# Altium project B202AA-PCIe.PrjPcb (part 1 of 2)
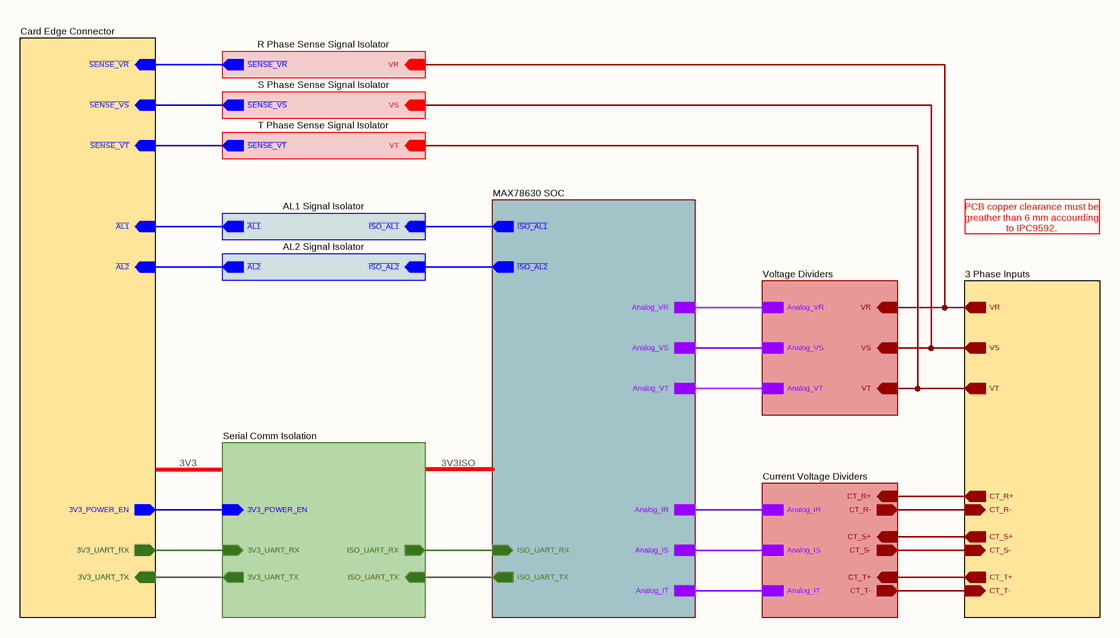
[diagram p0: Block Diagram.SchDoc]
Address1_: Buyuk Kayacik Mah. 4. OSB; Address2_: 103. Cad. No : 12; Address3_: Selcuklu / Konya; Address4_: Türkiye; Copyright_: Copyright 2022 STF Tarim (Commercial Secret); Customer_: -; Engineer_: Gunce Akkoyun; Git_Repo_Address_: www.github.com/akkoyun/B202AA-PCIe; Module_ID_: B202AA-PCIe; Organization_: -; Product_Desc_: PollyPhase Energy Analyzer; Product_ID_: B202AA-PCIe; Revision_: 00.00.01; Version_: R1
12 sheets, 136 parts. Net scope: hierarchical (ports join the sheet entries above them; power ports are global).
Board files: B202AA-PCIe.PcbDoc, B202AA.PcbDoc
Sheets:
  Block Diagram.SchDoc
    MAX78630 SOC = MAX78630 SOC.SchDoc
    Voltage Dividers = Phase Voltage Dividers.SchDoc
    Current Voltage Dividers = Current Voltage Dividers.SchDoc
    3 Phase Inputs = Energy Inputs.SchDoc
    Card Edge Connector = Card Edge Connecgtor.SchDoc
    R Phase Sense Signal Isolator = R Phase Sense Signal Isolation.SchDoc
    S Phase Sense Signal Isolator = S Phase Sense Signal Isolation.SchDoc
    T Phase Sense Signal Isolator = T Phase Sense Signal Isolation.SchDoc
    AL1 Signal Isolator = AL1 Signal Isolation.SchDoc
    AL2 Signal Isolator = AL2 Signal Isolation.SchDoc
    Serial Comm Isolation = UART Comm Isolation.SchDoc

## Sheet Block Diagram.SchDoc: B202AA Block Diagram
size 393 x 292 mm; SheetNumber: 1; SheetTotal: 12

### Sub-sheets
3 Phase Inputs = Energy Inputs.SchDoc: VS (out), VR (out), CT_S+ (out), CT_T+ (out), VT (out), CT_R+ (out), CT_R- (in), CT_S- (in), CT_T- (in)
AL1 Signal Isolator = AL1 Signal Isolation.SchDoc: ~{AL1} (out), ~{ISO_AL1} (in)
AL2 Signal Isolator = AL2 Signal Isolation.SchDoc: ~{AL2} (out), ~{ISO_AL2} (in)
Card Edge Connector = Card Edge Connecgtor.SchDoc: 3V3_UART_RX (out), 3V3_UART_TX (in), ~{AL2} (in), ~{AL1} (in), ~{SENSE_VT} (in), ~{SENSE_VS} (in), ~{SENSE_VR} (in), 3V3_POWER_EN (out)
Current Voltage Dividers = Current Voltage Dividers.SchDoc: Analog_IS, Analog_IT, Analog_IR, CT_T+ (in), CT_S+ (in), CT_R+ (in), CT_R- (out), CT_S- (out), CT_T- (out)
MAX78630 SOC = MAX78630 SOC.SchDoc: Analog_VR, Analog_VS, Analog_VT, Analog_IS, Analog_IT, Analog_IR, ISO_UART_RX (in), ISO_UART_TX (out), ~{ISO_AL1} (out), ~{ISO_AL2} (out)
R Phase Sense Signal Isolator = R Phase Sense Signal Isolation.SchDoc: ~{SENSE_VR} (out), VR (in)
S Phase Sense Signal Isolator = S Phase Sense Signal Isolation.SchDoc: ~{SENSE_VS} (out), VS (in)
Serial Comm Isolation = UART Comm Isolation.SchDoc: 3V3_UART_TX (out), 3V3_UART_RX (in), ISO_UART_RX (out), ISO_UART_TX (in), 3V3_POWER_EN (in)
T Phase Sense Signal Isolator = T Phase Sense Signal Isolation.SchDoc: ~{SENSE_VT} (out), VT (in)
Voltage Dividers = Phase Voltage Dividers.SchDoc: Analog_VR, Analog_VS, Analog_VT, VR (in), VT (in), VS (in)

### Nets
3V3_POWER_EN: sheet Card Edge Connector/3V3_POWER_EN, sheet Serial Comm Isolation/3V3_POWER_EN
3V3_UART_RX: sheet Card Edge Connector/3V3_UART_RX, sheet Serial Comm Isolation/3V3_UART_RX
3V3_UART_TX: sheet Card Edge Connector/3V3_UART_TX, sheet Serial Comm Isolation/3V3_UART_TX
~{AL1}: sheet Card Edge Connector/~{AL1}, sheet AL1 Signal Isolator/~{AL1}
~{AL2}: sheet Card Edge Connector/~{AL2}, sheet AL2 Signal Isolator/~{AL2}
Analog_IR: sheet MAX78630 SOC/Analog_IR, sheet Current Voltage Dividers/Analog_IR
Analog_IS: sheet MAX78630 SOC/Analog_IS, sheet Current Voltage Dividers/Analog_IS
Analog_IT: sheet MAX78630 SOC/Analog_IT, sheet Current Voltage Dividers/Analog_IT
Analog_VR: sheet MAX78630 SOC/Analog_VR, sheet Voltage Dividers/Analog_VR
Analog_VS: sheet MAX78630 SOC/Analog_VS, sheet Voltage Dividers/Analog_VS
Analog_VT: sheet MAX78630 SOC/Analog_VT, sheet Voltage Dividers/Analog_VT
CT_R+: sheet Current Voltage Dividers/CT_R+, sheet 3 Phase Inputs/CT_R+
CT_R-: sheet Current Voltage Dividers/CT_R-, sheet 3 Phase Inputs/CT_R-
CT_S+: sheet Current Voltage Dividers/CT_S+, sheet 3 Phase Inputs/CT_S+
CT_S-: sheet Current Voltage Dividers/CT_S-, sheet 3 Phase Inputs/CT_S-
CT_T+: sheet Current Voltage Dividers/CT_T+, sheet 3 Phase Inputs/CT_T+
CT_T-: sheet Current Voltage Dividers/CT_T-, sheet 3 Phase Inputs/CT_T-
~{ISO_AL1}: sheet MAX78630 SOC/~{ISO_AL1}, sheet AL1 Signal Isolator/~{ISO_AL1}
~{ISO_AL2}: sheet MAX78630 SOC/~{ISO_AL2}, sheet AL2 Signal Isolator/~{ISO_AL2}
ISO_UART_RX: sheet MAX78630 SOC/ISO_UART_RX, sheet Serial Comm Isolation/ISO_UART_RX
ISO_UART_TX: sheet MAX78630 SOC/ISO_UART_TX, sheet Serial Comm Isolation/ISO_UART_TX
~{SENSE_VR}: sheet Card Edge Connector/~{SENSE_VR}, sheet R Phase Sense Signal Isolator/~{SENSE_VR}
~{SENSE_VS}: sheet Card Edge Connector/~{SENSE_VS}, sheet S Phase Sense Signal Isolator/~{SENSE_VS}
~{SENSE_VT}: sheet Card Edge Connector/~{SENSE_VT}, sheet T Phase Sense Signal Isolator/~{SENSE_VT}
VR: sheet Voltage Dividers/VR, sheet 3 Phase Inputs/VR, sheet R Phase Sense Signal Isolator/VR
VS: sheet Voltage Dividers/VS, sheet 3 Phase Inputs/VS, sheet S Phase Sense Signal Isolator/VS
VT: sheet Voltage Dividers/VT, sheet 3 Phase Inputs/VT, sheet T Phase Sense Signal Isolator/VT

### Notes on the sheet
- PCB copper clearance must be greather than 6 mm accourding to IPC9592.
- 3V3
- 3V3ISO
- © 2021 All rights reserved.
  This document may not, in whole or in part, be copied, photocopied, reproduced, translated or converted to any electronic or machine readable from without prior written permission of Mehmet Günce Akkoyun.
  Engineer contact : akkoyun@me.com
- Property of
- Engineer :
- Date :
- Size :
- A4
- Time :
- Project :
- Page :
- /
- Customer :
- Product ID :
- Module ID :
- Version :
- File :
- Revision :

## Sheet MAX78630 SOC.SchDoc: MAX78630 SOC Core
size 393 x 292 mm; SheetNumber: 12; SheetTotal: 12
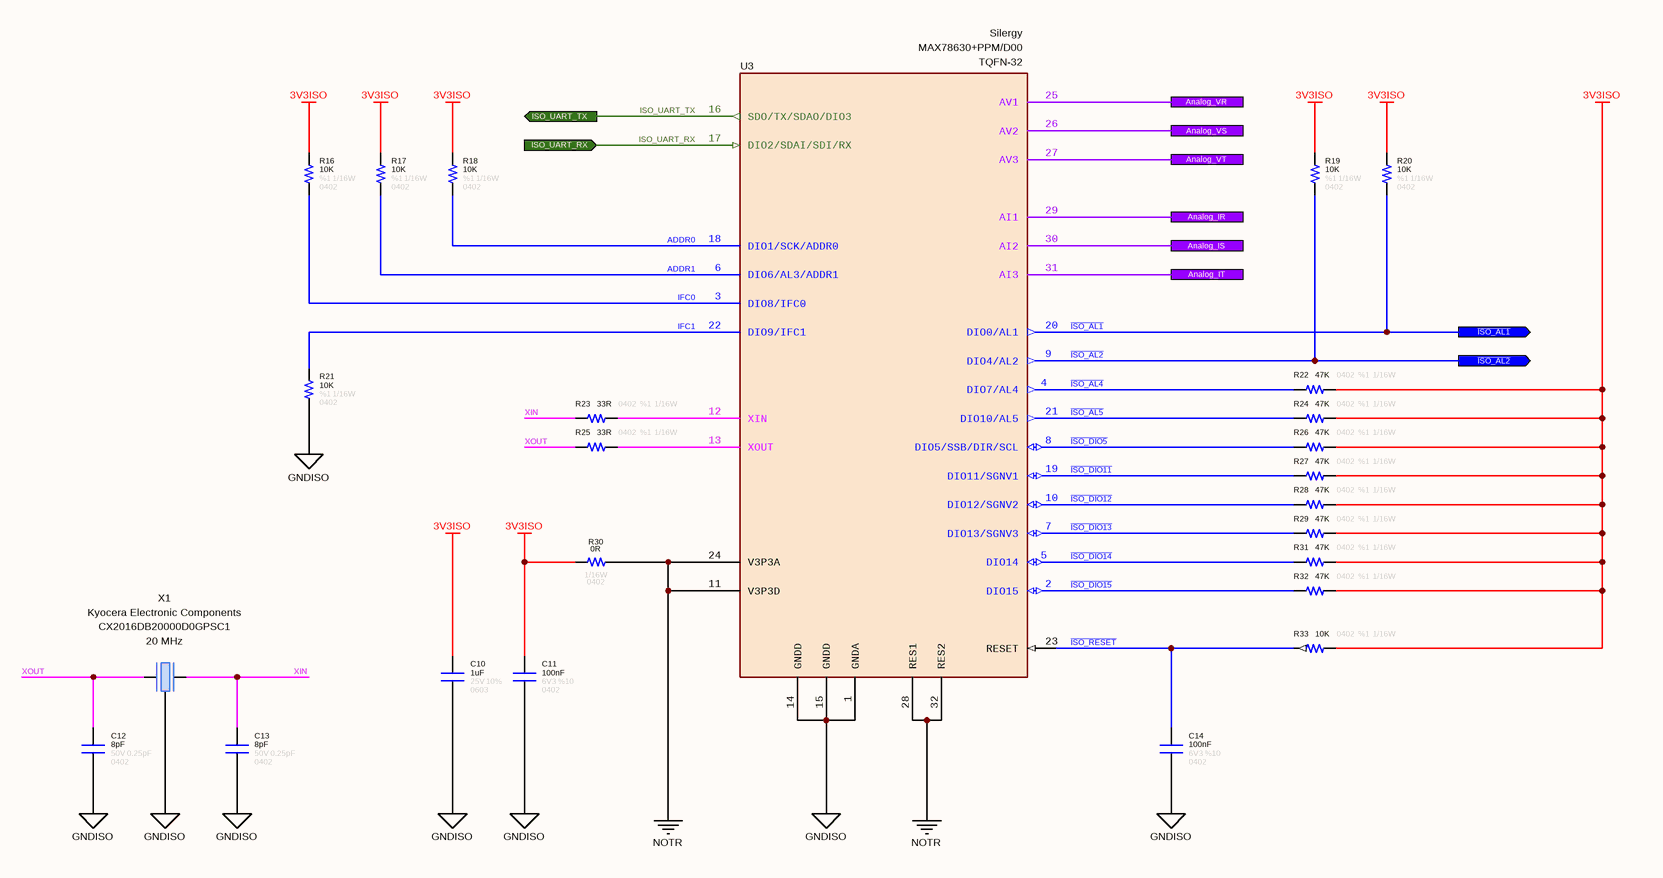
[diagram p1: MAX78630 SOC.SchDoc]

### Parts
C10  value 1uF  Tolerance: 10%  Case: 0603  Voltage: 25V  [CAPACITOR_0603]  (hidden comment: Capacitor - 1uF [0603] (MLCC))
C11  value 100nF  Tolerance: %10  Voltage: 6V3  Case: 0402  [CAPACITOR_0402]  (hidden comment: Capacitor - 100nF [0402] (Ceramic))
C12  value 8pF  Tolerance: 0.25pF  Case: 0402  Voltage: 50V  [CAPACITOR_0402]  (hidden comment: Capacitor - 8pF [0402] (Ceramic))
C13  value 8pF  Tolerance: 0.25pF  Case: 0402  Voltage: 50V  [CAPACITOR_0402]  (hidden comment: Capacitor - 8pF [0402] (Ceramic))
C14  value 100nF  Tolerance: %10  Voltage: 6V3  Case: 0402  [CAPACITOR_0402]  (hidden comment: Capacitor - 100nF [0402] (Ceramic))
R16  value 10K  Tolerance: %1  Case: 0402  Power: 1/16W  [RESISTOR_0402]  (hidden comment: 10K - 0402 - %1 - 1/16W)
R17  value 10K  Tolerance: %1  Case: 0402  Power: 1/16W  [RESISTOR_0402]  (hidden comment: 10K - 0402 - %1 - 1/16W)
R18  value 10K  Tolerance: %1  Case: 0402  Power: 1/16W  [RESISTOR_0402]  (hidden comment: 10K - 0402 - %1 - 1/16W)
R19  value 10K  Tolerance: %1  Case: 0402  Power: 1/16W  [RESISTOR_0402]  (hidden comment: 10K - 0402 - %1 - 1/16W)
R20  value 10K  Tolerance: %1  Case: 0402  Power: 1/16W  [RESISTOR_0402]  (hidden comment: 10K - 0402 - %1 - 1/16W)
R21  value 10K  Tolerance: %1  Case: 0402  Power: 1/16W  [RESISTOR_0402]  (hidden comment: 10K - 0402 - %1 - 1/16W)
R22  value 47K  Tolerance: %1  Case: 0402  Power: 1/16W  [RESISTOR_0402]  (hidden comment: 47K - 0402 - %1 - 1/16W)
R23  value 33R  Case: 0402  Tolerance: %1  Power: 1/16W  [RESISTOR_0402]  (hidden comment: 33R - 0402 - %1 - 1/16W)
R24  value 47K  Tolerance: %1  Case: 0402  Power: 1/16W  [RESISTOR_0402]  (hidden comment: 47K - 0402 - %1 - 1/16W)
R25  value 33R  Case: 0402  Tolerance: %1  Power: 1/16W  [RESISTOR_0402]  (hidden comment: 33R - 0402 - %1 - 1/16W)
R26  value 47K  Tolerance: %1  Case: 0402  Power: 1/16W  [RESISTOR_0402]  (hidden comment: 47K - 0402 - %1 - 1/16W)
R27  value 47K  Tolerance: %1  Case: 0402  Power: 1/16W  [RESISTOR_0402]  (hidden comment: 47K - 0402 - %1 - 1/16W)
R28  value 47K  Tolerance: %1  Case: 0402  Power: 1/16W  [RESISTOR_0402]  (hidden comment: 47K - 0402 - %1 - 1/16W)
R29  value 47K  Tolerance: %1  Case: 0402  Power: 1/16W  [RESISTOR_0402]  (hidden comment: 47K - 0402 - %1 - 1/16W)
R30  value 0R  Case: 0402  Power: 1/16W  [RESISTOR_0402]  (hidden comment: 0R - 0402 - %1 - 1/16W)
R31  value 47K  Tolerance: %1  Case: 0402  Power: 1/16W  [RESISTOR_0402]  (hidden comment: 47K - 0402 - %1 - 1/16W)
R32  value 47K  Tolerance: %1  Case: 0402  Power: 1/16W  [RESISTOR_0402]  (hidden comment: 47K - 0402 - %1 - 1/16W)
R33  value 10K  Tolerance: %1  Case: 0402  Power: 1/16W  [RESISTOR_0402]  (hidden comment: 10K - 0402 - %1 - 1/16W)
U3  Manufacturer Name: Silergy  Case: TQFN-32  [TQFN-32 - Maxim]  (hidden comment: MAX78630+PPM/D00)
X1  Manufacturer Name: Kyocera Electronic Components  Frequency: 20 MHz  [CRYSTAL - 20MHz]  (hidden comment: CX2016DB20000D0GPSC1)

### Ports
Analog_IR, Analog_IS, Analog_IT, Analog_VR, Analog_VS, Analog_VT, ISO_UART_RX (in), ISO_UART_TX (out), ~{ISO_AL1} (out), ~{ISO_AL2} (out)

### Nets
3V3ISO: C10.2 C11.2 R16.2 R17.2 R18.2 R19.2 R20.2 R22.1 R24.1 R26.1 R27.1 R28.1 R29.1 R30.2 R31.1 R32.1 R33.1
GNDISO: C10.1 C11.1 C12.1 C13.1 C14.1 R21.1 U3.1(GNDA) U3.14(GNDD) U3.15(GNDD) X1.2(GND)
NOTR: R30.1 U3.11(V3P3D) U3.24(V3P3A) U3.28(RES1) U3.32(RES2)
ADDR0: R18.1 U3.18(DIO1/SCK/ADDR0)
ADDR1: R17.1 U3.6(DIO6/AL3/ADDR1)
Analog_IR: U3.29(AI1) ; port Analog_IR
Analog_IS: U3.30(AI2) ; port Analog_IS
Analog_IT: U3.31(AI3) ; port Analog_IT
Analog_VR: U3.25(AV1) ; port Analog_VR
Analog_VS: U3.26(AV2) ; port Analog_VS
Analog_VT: U3.27(AV3) ; port Analog_VT
~{ISO_AL1}: R20.1 U3.20(DIO0/AL1) ; port ~{ISO_AL1}
~{ISO_AL2}: R19.1 U3.9(DIO4/AL2) ; port ~{ISO_AL2}
~{ISO_AL4}: R22.2 U3.4(DIO7/AL4)
~{ISO_AL5}: R24.2 U3.21(DIO10/AL5)
~{ISO_DIO11}: R27.2 U3.19(DIO11/SGNV1)
~{ISO_DIO12}: R28.2 U3.10(DIO12/SGNV2)
~{ISO_DIO13}: R29.2 U3.7(DIO13/SGNV3)
~{ISO_DIO14}: R31.2 U3.5(DIO14)
~{ISO_DIO15}: R32.2 U3.2(DIO15)
~{ISO_DIO5}: R26.2 U3.8(DIO5/SSB/DIR/SCL)
~{ISO_RESET}: C14.2 R33.2 U3.23(RESET)
IFC0: R16.1 U3.3(DIO8/IFC0)
IFC1: R21.2 U3.22(DIO9/IFC1)
ISO_UART_RX: U3.17(DIO2/SDAI/SDI/RX) ; port ISO_UART_RX
ISO_UART_TX: U3.16(SDO/TX/SDAO/DIO3) ; port ISO_UART_TX
XIN: C13.2 R23.2 X1.1(IN/OUT)
XOUT: C12.2 R25.2 X1.3(OUT/IN)
NetR23_1: R23.1 U3.12(XIN)
NetR25_1: R25.1 U3.13(XOUT)

Not connected (* = marked no-connect by the designer): X1 4(GND)

### Notes on the sheet
- © 2021 All rights reserved.
  This document may not, in whole or in part, be copied, photocopied, reproduced, translated or converted to any electronic or machine readable from without prior written permission of Mehmet Günce Akkoyun.
  Engineer contact : akkoyun@me.com
- Property of
- Engineer :
- Date :
- Size :
- A4
- Time :
- Project :
- Page :
- /
- Customer :
- Product ID :
- Module ID :
- Version :
- File :
- Revision :

### Library data of the parts
C10 = Capacitor - 1uF [0603-25V]: Capacitor (MLCC) - 1uF / 25V / 0603; Manufacturer Part Number: GCJ188R71E105KA01D; Manufacturer Name: Murata Electronics; ComponentLink1Description: DataSheet; ComponentLink1URL: https://www.mouser.com.tr/datasheet/2/281/1/GCJ188R71E105KA01_02B-3140112.pdf; ComponentLink2Description: Mouser; ComponentLink2URL: https://www.mouser.com.tr/ProductDetail/Murata-Electronics/GCJ188R71E105KA01D?qs=rnuWwpjhhVuRpUqK416FbQ%3D%3D; Subcategory: Capacitors
C11 C14 = Capacitor - 100nF [0402-6V3]: Capacitor - 100nF [0402-6V3] (Ceramic); Manufacturer Name: AVX; Manufacturer Part Number: 04026D104KAT4A; ComponentLink1Description: Mouser; ComponentLink1URL: https://www.mouser.com.tr/ProductDetail/AVX/04026D104KAT4A?qs=sGAEpiMZZMs0AnBnWHyRQPg4iYkCw7IMED%2F4kpqgf7w%3D; ComponentLink2Description: DataSheet; ComponentLink2URL: https://www.mouser.com.tr/datasheet/2/40/cx5r-776519.pdf
C12 C13 = Capacitor - 8pF [0402-50V]: Manufacturer Name: KYOCERA AVX; Manufacturer Part Number: 04025A8R0CAT2A
R16-R21 R33 = Resistor - 10K [0402]: Thick Film Resistors - SMD 1/16 W 10 KOhm 1%; Manufacturer Name: Vishay; Manufacturer Part Number: CRCW040210K0FKED; ComponentLink1Description: DataSheet; ComponentLink1URL: https://www.mouser.com.tr/datasheet/2/427/dcrcwe3-1762152.pdf; ComponentLink2Description: Mouser; ComponentLink2URL: https://www.mouser.com.tr/ProductDetail/Vishay-Dale/CRCW040210K0FKED?qs=sGAEpiMZZMu61qfTUdNhG2DpbjADlD3GcalbOv9utCY%3D
R22 R24 R26-R29 R31 R32 = Resistor - 47K [0402]: Thick Film Resistors - SMD 1/16 W 47 KOhm 1%; Manufacturer Name: Vishay; Manufacturer Part Number: CRCW040247K0FKED; ComponentLink1Description: DataSheet; ComponentLink1URL: https://www.mouser.com.tr/datasheet/2/427/dcrcwe3-1762152.pdf; ComponentLink2Description: Mouser; ComponentLink2URL: https://www.mouser.com.tr/ProductDetail/Vishay-Dale/CRCW040247K0FKED?qs=sGAEpiMZZMu61qfTUdNhG2DpbjADlD3GL%252B3h1elTxqU%3D
R23 R25 = Resistor - 33R [0402]: Thick Film Resistors - SMD 1/16 W 33 Ohm 1%; Manufacturer Name: Vishay; Manufacturer Part Number: CRCW040233R0FKED; ComponentLink1Description: DataSheet; ComponentLink1URL: https://www.mouser.com.tr/datasheet/2/427/dcrcwe3-1762152.pdf; ComponentLink2Description: Mouser; ComponentLink2URL: https://www.mouser.com.tr/ProductDetail/Vishay-Dale/CRCW0402330RFKED?qs=sGAEpiMZZMu61qfTUdNhG2DpbjADlD3GGS6SwBlLi5Q%3D
R30 = Resistor - 0R [0402]: Thick Film Resistors - SMD 1/16 W 0 Ohm; Manufacturer Name: Vishay; Manufacturer Part Number: CRCW04020000Z0ED; ComponentLink1Description: DataSheet; ComponentLink1URL: https://www.mouser.com.tr/datasheet/2/427/dcrcwe3-1762152.pdf; ComponentLink2Description: Mouser; ComponentLink2URL: https://www.mouser.com.tr/ProductDetail/Vishay-Dale/CRCW04020000Z0ED?qs=sGAEpiMZZMu61qfTUdNhG2DpbjADlD3GG34cJb50zyg%3D
U3 = IC - MAX78630: Energy Measurement Processor 32-Pin TQFN EP Tube; RoHS: Yes; Manufacturer Part Number: MAX78630+PPM/D00
X1 = Crystal - 20MHz: Crystals AEC-Q200 20000kHz 8pF 2x1.6mm; Case: SMD; Manufacturer Part Number: CX2016DB20000D0GPSC1

## Sheet Phase Voltage Dividers.SchDoc: 3 Phase Voltage Dividers
size 292 x 193 mm; SheetNumber: 10; SheetTotal: 12
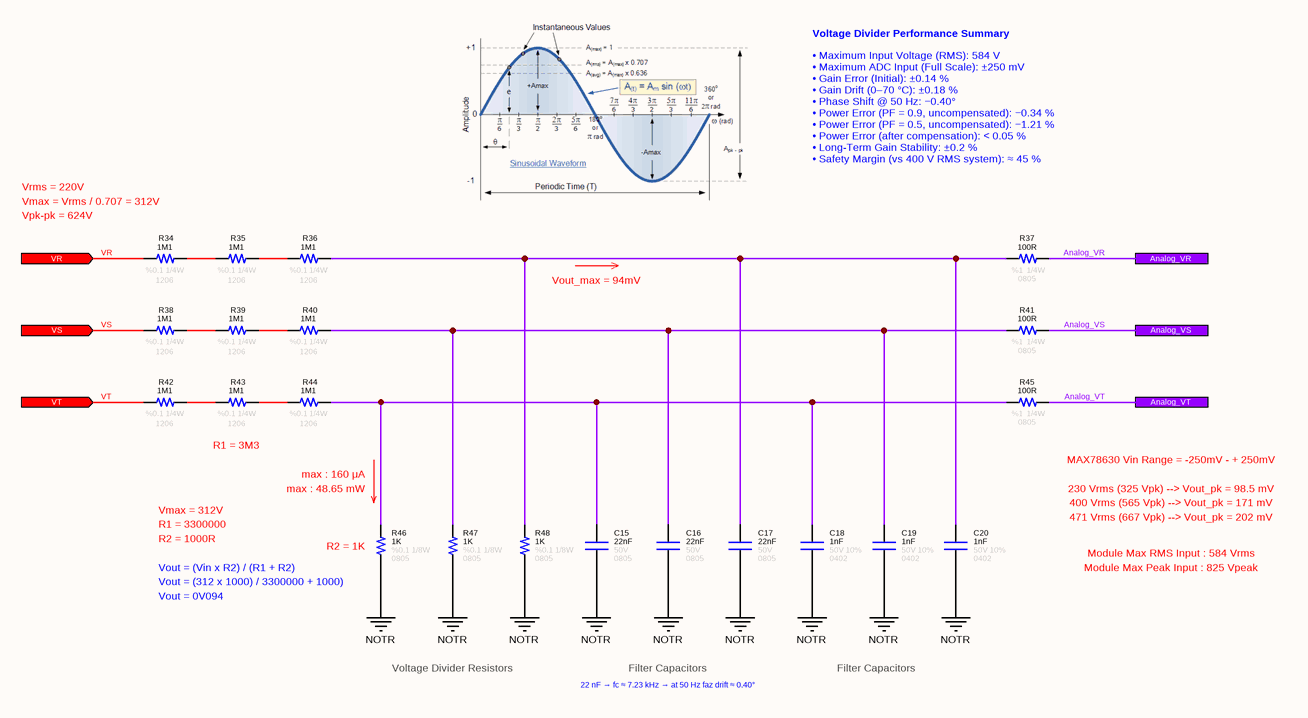
[diagram p2: Phase Voltage Dividers.SchDoc]

### Parts
C15  value 22nF  Case: 0805  Voltage: 50V  [CAPACITOR_0805]  (hidden comment: Capacitor - 22nF [0805] (MLCC))
C16  value 22nF  Case: 0805  Voltage: 50V  [CAPACITOR_0805]  (hidden comment: Capacitor - 22nF [0805] (MLCC))
C17  value 22nF  Case: 0805  Voltage: 50V  [CAPACITOR_0805]  (hidden comment: Capacitor - 22nF [0805] (MLCC))
C18  value 1nF  Tolerance: 10%  Case: 0402  Voltage: 50V  [CAPACITOR_0402]  (hidden comment: Capacitor - 1nF [0402] (MLCC))
C19  value 1nF  Tolerance: 10%  Case: 0402  Voltage: 50V  [CAPACITOR_0402]  (hidden comment: Capacitor - 1nF [0402] (MLCC))
C20  value 1nF  Tolerance: 10%  Case: 0402  Voltage: 50V  [CAPACITOR_0402]  (hidden comment: Capacitor - 1nF [0402] (MLCC))
R34  value 1M1  Case: 1206  Tolerance: %0.1  Power: 1/4W  [RESISTOR_1206]  (hidden comment: 1M1 - 1206 - %1 - 1/4W)
R35  value 1M1  Case: 1206  Tolerance: %0.1  Power: 1/4W  [RESISTOR_1206]  (hidden comment: 1M1 - 1206 - %1 - 1/4W)
R36  value 1M1  Case: 1206  Tolerance: %0.1  Power: 1/4W  [RESISTOR_1206]  (hidden comment: 1M1 - 1206 - %1 - 1/4W)
R37  value 100R  Case: 0805  Tolerance: %1  Power: 1/4W  [RESISTOR_0805]  (hidden comment: 100R - 0805 - %1 - 1/4W)
R38  value 1M1  Case: 1206  Tolerance: %0.1  Power: 1/4W  [RESISTOR_1206]  (hidden comment: 1M1 - 1206 - %1 - 1/4W)
R39  value 1M1  Case: 1206  Tolerance: %0.1  Power: 1/4W  [RESISTOR_1206]  (hidden comment: 1M1 - 1206 - %1 - 1/4W)
R40  value 1M1  Case: 1206  Tolerance: %0.1  Power: 1/4W  [RESISTOR_1206]  (hidden comment: 1M1 - 1206 - %1 - 1/4W)
R41  value 100R  Case: 0805  Tolerance: %1  Power: 1/4W  [RESISTOR_0805]  (hidden comment: 100R - 0805 - %1 - 1/4W)
R42  value 1M1  Case: 1206  Tolerance: %0.1  Power: 1/4W  [RESISTOR_1206]  (hidden comment: 1M1 - 1206 - %1 - 1/4W)
R43  value 1M1  Case: 1206  Tolerance: %0.1  Power: 1/4W  [RESISTOR_1206]  (hidden comment: 1M1 - 1206 - %1 - 1/4W)
R44  value 1M1  Case: 1206  Tolerance: %0.1  Power: 1/4W  [RESISTOR_1206]  (hidden comment: 1M1 - 1206 - %1 - 1/4W)
R45  value 100R  Case: 0805  Tolerance: %1  Power: 1/4W  [RESISTOR_0805]  (hidden comment: 100R - 0805 - %1 - 1/4W)
R46  value 1K  Tolerance: %0.1  Case: 0805  Power: 1/8W  [RESISTOR_0805]  (hidden comment: 1K - 0805 - %0.1 - 1/8W)
R47  value 1K  Tolerance: %0.1  Case: 0805  Power: 1/8W  [RESISTOR_0805]  (hidden comment: 1K - 0805 - %0.1 - 1/8W)
R48  value 1K  Tolerance: %0.1  Case: 0805  Power: 1/8W  [RESISTOR_0805]  (hidden comment: 1K - 0805 - %0.1 - 1/8W)

### Ports
Analog_VR, Analog_VS, Analog_VT, VR (in), VS (in), VT (in)

### Nets
NOTR: C15.1 C16.1 C17.1 C18.1 C19.1 C20.1 R46.1 R47.1 R48.1
Analog_VR: R37.1 ; port Analog_VR
Analog_VS: R41.1 ; port Analog_VS
Analog_VT: R45.1 ; port Analog_VT
VR: R34.2 ; port VR
VS: R38.2 ; port VS
VT: R42.2 ; port VT
NetC15_2: C15.2 C18.2 R44.1 R45.2 R46.2
NetC16_2: C16.2 C19.2 R40.1 R41.2 R47.2
NetC17_2: C17.2 C20.2 R36.1 R37.2 R48.2
NetR34_1: R34.1 R35.2
NetR35_1: R35.1 R36.2
NetR38_1: R38.1 R39.2
NetR39_1: R39.1 R40.2
NetR42_1: R42.1 R43.2
NetR43_1: R43.1 R44.2

### Notes on the sheet
- Voltage Divider Performance Summary
- Vrms = 220V
- (near R34) Vmax = Vrms / 0.707 = 312V
- Vpk-pk = 624V
- • Maximum Input Voltage (RMS): 584 V
  • Maximum ADC Input (Full Scale): ±250 mV
  • Gain Error (Initial): ±0.14 %
  • Gain Drift (0–70 °C): ±0.18 %
  • Phase Shift @ 50 Hz: −0.40°
  • Power Error (PF = 0.9, uncompensated): −0.34 %
  • Power Error (PF = 0.5, uncompensated): −1.21 %
  • Power Error (after compensation): < 0.05 %
  • Long-Term Gain Stability: ±0.2 %
  • Safety Margin (vs 400 V RMS system): ≈ 45 %
- Vout_max = 94mV
- R1 = 3M3
- max : 160 μA
- (near R46) max : 48.65 mW
- MAX78630 Vin Range = -250mV - + 250mV
- 230 Vrms (325 Vpk) --> Vout_pk = 98.5 mV
- 400 Vrms (565 Vpk) --> Vout_pk = 171 mV
- Vout = (Vin x R2) / (R1 + R2)
- Vmax = 312V
- R1 = 3300000
- R2 = 1000R
- (near R46) Vout = (312 x 1000) / 3300000 + 1000)
- (near R46) R2 = 1K
- Module Max RMS Input : 584 Vrms
- Module Max Peak Input : 825 Vpeak
- 471 Vrms (667 Vpk) --> Vout_pk = 202 mV
- Vout = 0V094
- Voltage Divider Resistors
- 22 nF → fc ≈ 7.23 kHz → at 50 Hz faz drift ≈ 0.40°
- Filter Capacitors
- © 2021 All rights reserved.
  This document may not, in whole or in part, be copied, photocopied, reproduced, translated or converted to any electronic or machine readable from without prior written permission of Mehmet Günce Akkoyun.
  Engineer contact : akkoyun@me.com
- Property of
- Engineer :
- Date :
- Size :
- A4
- Time :
- Project :
- Page :
- /
- Customer :
- Product ID :
- Module ID :
- Version :
- File :
- Revision :

### Library data of the parts
C15-C17 = Capacitor - 22nF [0805-50V]: Capacitor (MLCC) - 22nF / 50V / 0805; Manufacturer Name: Yageo; Manufacturer Part Number: C0805C223K5RACTU; Tolerance: 10%; Subcategory: Capacitors
C18-C20 = Capacitor - 1nF [0402-50V]: Capacitor (MLCC) - 1nF / 50V / 0402; Manufacturer Name: Murata; Manufacturer Part Number: GRM155R71H102KA01D; Subcategory: Capacitors
R34-R36 R38-R40 R42-R44 = Resistor - 1M1 [1206] %0.1: Thick Film Resistors - SMD 1/4 W 1.1 MOhm 0.1%; Manufacturer Name: Yageo; Manufacturer Part Number: RT1206BRD071M1L
R37 R41 R45 = Resistor - 100R [0805]: Thick Film Resistors - SMD 1/4 W 100 Ohm 1%; Manufacturer Name: Vishay; Manufacturer Part Number: CRCW0805100RFKEA
R46-R48 = Resistor - 1K [0805]: Thick Film Resistors - SMD 1/8 W 1 KOhm 0.1%; Manufacturer Name: Panasonic; Manufacturer Part Number: ERA-6AEB102V

## Sheet Current Voltage Dividers.SchDoc: 3 Phase Current Voltage Dividers
size 292 x 193 mm; SheetNumber: 11; SheetTotal: 12
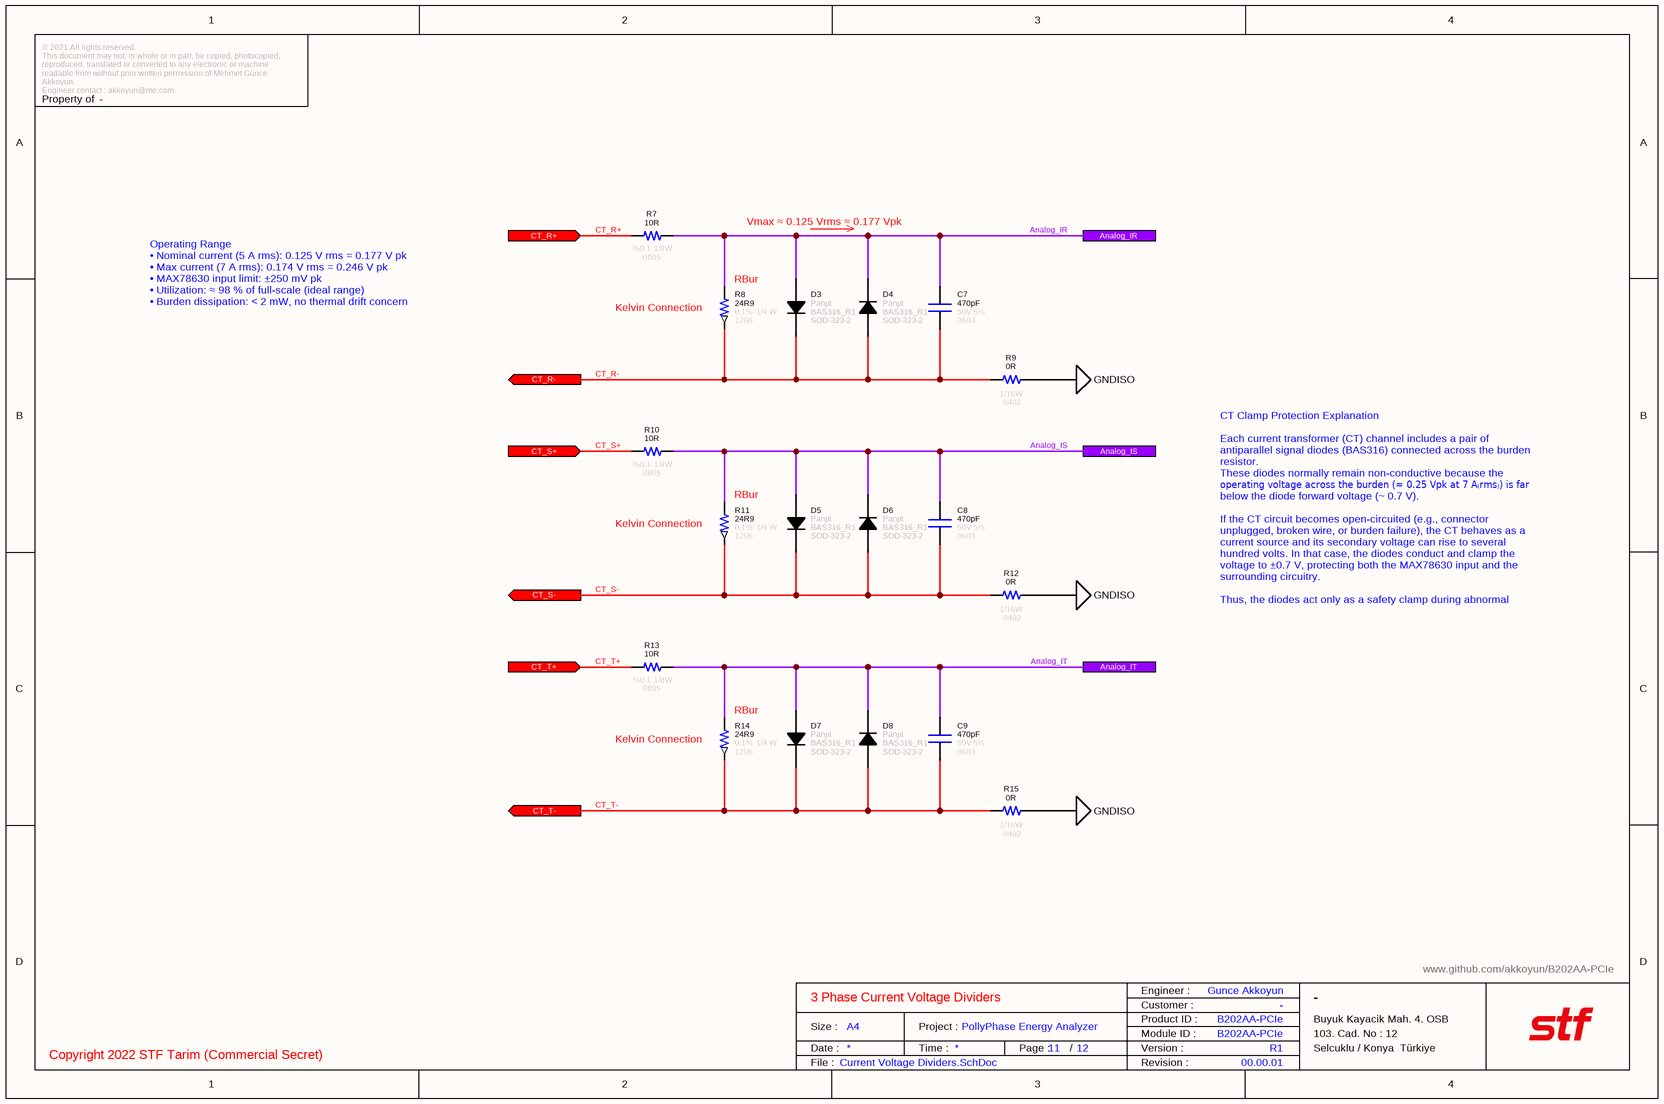
[diagram p3: Current Voltage Dividers.SchDoc]

### Parts
C7  value 470pF  Tolerance: 5%  Case: 0603  Voltage: 50V  [CAPACITOR_0603]  (hidden comment: Capacitor - 470pF [0603] (MLCC))
C8  value 470pF  Tolerance: 5%  Case: 0603  Voltage: 50V  [CAPACITOR_0603]  (hidden comment: Capacitor - 470pF [0603] (MLCC))
C9  value 470pF  Tolerance: 5%  Case: 0603  Voltage: 50V  [CAPACITOR_0603]  (hidden comment: Capacitor - 470pF [0603] (MLCC))
D3  Manufacturer Name: Panjit  Manufacturer Part Number: BAS316_R1  [SOD-323-2]  (hidden comment: BAS316_R1_00001)
D4  Manufacturer Name: Panjit  Manufacturer Part Number: BAS316_R1  [SOD-323-2]  (hidden comment: BAS316_R1_00001)
D5  Manufacturer Name: Panjit  Manufacturer Part Number: BAS316_R1  [SOD-323-2]  (hidden comment: BAS316_R1_00001)
D6  Manufacturer Name: Panjit  Manufacturer Part Number: BAS316_R1  [SOD-323-2]  (hidden comment: BAS316_R1_00001)
D7  Manufacturer Name: Panjit  Manufacturer Part Number: BAS316_R1  [SOD-323-2]  (hidden comment: BAS316_R1_00001)
D8  Manufacturer Name: Panjit  Manufacturer Part Number: BAS316_R1  [SOD-323-2]  (hidden comment: BAS316_R1_00001)
R7  value 10R  Tolerance: %0.1  Case: 0805  Power: 1/8W  [RESISTOR_0805]  (hidden comment: 10R - 0805 - %0.1 - 1/8W)
R8  value 24R9  Tolerance: 0.1%  Power: 1/4 W  Case: 1206  [RESISTOR_1206]  (hidden comment: 24R9 - 1206 - %0.1 - 1/4W)
R9  value 0R  Case: 0402  Power: 1/16W  [RESISTOR_0402]  (hidden comment: 0R - 0402 - %1 - 1/16W)
R10  value 10R  Tolerance: %0.1  Case: 0805  Power: 1/8W  [RESISTOR_0805]  (hidden comment: 10R - 0805 - %0.1 - 1/8W)
R11  value 24R9  Tolerance: 0.1%  Power: 1/4 W  Case: 1206  [RESISTOR_1206]  (hidden comment: 24R9 - 1206 - %0.1 - 1/4W)
R12  value 0R  Case: 0402  Power: 1/16W  [RESISTOR_0402]  (hidden comment: 0R - 0402 - %1 - 1/16W)
R13  value 10R  Tolerance: %0.1  Case: 0805  Power: 1/8W  [RESISTOR_0805]  (hidden comment: 10R - 0805 - %0.1 - 1/8W)
R14  value 24R9  Tolerance: 0.1%  Power: 1/4 W  Case: 1206  [RESISTOR_1206]  (hidden comment: 24R9 - 1206 - %0.1 - 1/4W)
R15  value 0R  Case: 0402  Power: 1/16W  [RESISTOR_0402]  (hidden comment: 0R - 0402 - %1 - 1/16W)

### Ports
Analog_IR, Analog_IS, Analog_IT, CT_R+ (in), CT_R- (out), CT_S+ (in), CT_S- (out), CT_T+ (in), CT_T- (out)

### Nets
GNDISO: R9.1 R12.1 R15.1
Analog_IR: C7.2 D3.2(Anode) D4.1(Cathode) R7.1 R8.2 ; port Analog_IR
Analog_IS: C8.2 D5.2(Anode) D6.1(Cathode) R10.1 R11.2 ; port Analog_IS
Analog_IT: C9.2 D7.2(Anode) D8.1(Cathode) R13.1 R14.2 ; port Analog_IT
CT_R+: R7.2 ; port CT_R+
CT_R-: C7.1 D3.1(Cathode) D4.2(Anode) R8.1 R9.2 ; port CT_R-
CT_S+: R10.2 ; port CT_S+
CT_S-: C8.1 D5.1(Cathode) D6.2(Anode) R11.1 R12.2 ; port CT_S-
CT_T+: R13.2 ; port CT_T+
CT_T-: C9.1 D7.1(Cathode) D8.2(Anode) R14.1 R15.2 ; port CT_T-

### Notes on the sheet
- Vmax ≈ 0.125 Vrms ≈ 0.177 Vpk
- Operating Range
  • Nominal current (5 A rms): 0.125 V rms = 0.177 V pk
  • Max current (7 A rms): 0.174 V rms = 0.246 V pk
  • MAX78630 input limit: ±250 mV pk
  • Utilization: ≈ 98 % of full-scale (ideal range)
  • Burden dissipation: < 2 mW, no thermal drift concern
- (near R8) Kelvin Connection
- (near R8) RBur
- (near R11) Kelvin Connection
- (near R11) RBur
- CT Clamp Protection Explanation
  Each current transformer (CT) channel includes a pair of antiparallel signal diodes (BAS316) connected across the burden resistor.
  These diodes normally remain non-conductive because the operating voltage across the burden (≈ 0.25 Vpk at 7 A₍rms₎) is far below the diode forward voltage (~ 0.7 V).
  If the CT circuit becomes open-circuited (e.g., connector unplugged, broken wire, or burden failure), the CT behaves as a current source and its secondary voltage can rise to several hundred volts. In that case, the diodes conduct and clamp the voltage to ±0.7 V, protecting both the MAX78630 input and the surrounding circuitry.
  Thus, the diodes act only as a safety clamp during abnormal conditions, without affecting normal measurement accuracy or phase angle.
- (near R14) Kelvin Connection
- (near R14) RBur
- © 2021 All rights reserved.
  This document may not, in whole or in part, be copied, photocopied, reproduced, translated or converted to any electronic or machine readable from without prior written permission of Mehmet Günce Akkoyun.
  Engineer contact : akkoyun@me.com
- Property of
- Engineer :
- Date :
- Size :
- A4
- Time :
- Project :
- Page :
- /
- Customer :
- Product ID :
- Module ID :
- Version :
- File :
- Revision :

### Library data of the parts
C7-C9 = Capacitor - 470 pF [0603-50V]: Capacitor (MLCC) - 470pF / 50V / 0603; Manufacturer Name: Murata; Manufacturer Part Number: GRM1885C1H471JA01; Subcategory: Capacitors
D3-D8 = Diode - BAS316_R1_00001: Small Signal Switching Diodes 100V,Small Signal Switching Diodes,SOD-323,4A; Forward Voltage: 150 mV; Forward Current: 4 A; Maximum Operating Temperature: + 150 C; Minimum Operating Temperature: - 55 C; Product Type: Small Signal Switching Diodes; RoHS: Yes; Case: SOD-323-2
R7 R10 R13 = Resistor - 10R [0805]: Thick Film Resistors - SMD 1/8 W 10 Ohm 0.1%; Manufacturer Name: Yageo; Manufacturer Part Number: RT0805BRD0710RL
R8 R11 R14 = Resistor - 24R9 [1206]: Burden Resistors - SMD 1/4 W 24.9 Ohm 0.1%; Manufacturer Part Number: RT1206BRD0724R9L; Manufacturer Name: Yageo
R9 R12 R15 = Resistor - 0R [0402]: as R30 on sheet MAX78630 SOC; ComponentLink1Description: DataSheet; ComponentLink1URL: https://www.mouser.com.tr/datasheet/2/427/dcrcwe3-1762152.pdf; ComponentLink2Description: Mouser; ComponentLink2URL: https://www.mouser.com.tr/ProductDetail/Vishay-Dale/CRCW04020000Z0ED?qs=sGAEpiMZZMu61qfTUdNhG2DpbjADlD3GG34cJb50zyg%3D

## Sheet Energy Inputs.SchDoc: Energy Inputs
size 292 x 193 mm; SheetNumber: 9; SheetTotal: 12
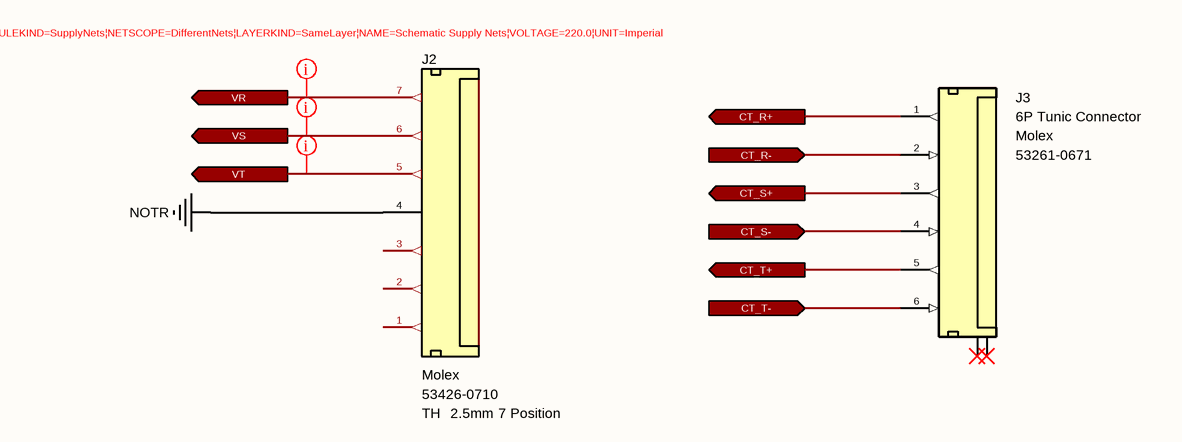
[diagram p4: Energy Inputs.SchDoc]

### Parts
J2  Manufacturer Name: Molex  Case: TH  Pitch: 2.5mm  Position: 7 Position  [Connector 7P (2.54)]  (hidden comment: 53426-0710)
J3  6P Tunic Connector  Manufacturer Part Number: 53261-0671  Manufacturer Name: Molex  [Connector_Tunic 6P]

### Ports
CT_R+ (out), CT_R- (in), CT_S+ (out), CT_S- (in), CT_T+ (out), CT_T- (in), VR (out), VS (out), VT (out)

### Nets
NOTR: J2.4(Pin-4)
CT_R+: J3.1(CT_R+) ; port CT_R+
CT_R-: J3.2(CT_R-) ; port CT_R-
CT_S+: J3.3(CT_S+) ; port CT_S+
CT_S-: J3.4(CT_S-) ; port CT_S-
CT_T+: J3.5(CT_T+) ; port CT_T+
CT_T-: J3.6(CT_T-) ; port CT_T-
VR: J2.7(Pin-7) ; port VR
VS: J2.6(Pin-6) ; port VS
VT: J2.5(Pin-5) ; port VT

Not connected (* = marked no-connect by the designer): J2 1(Pin-1) 2(Pin-2) 3(Pin-3); J3 7(Case)* 8(Case)*

### Layout directives
rule Supply Nets [Voltage = 220.0]; net class HV: VR, VS, VT

### Notes on the sheet
- © 2021 All rights reserved.
  This document may not, in whole or in part, be copied, photocopied, reproduced, translated or converted to any electronic or machine readable from without prior written permission of Mehmet Günce Akkoyun.
  Engineer contact : akkoyun@me.com
- Property of
- Engineer :
- Date :
- Size :
- A4
- Time :
- Project :
- Page :
- /
- Customer :
- Product ID :
- Module ID :
- Version :
- File :
- Revision :

### Library data of the parts
J2 = Connector - Tunic 7P (2.5): 2.50mm Pitch Mini-Lock Wire-to-Board Header Right Angle Friction and Positive Lock 7 Circuits; System: Connector; Manufacturer Part Number: 53426-0710
J3 = Connector - Mini Tunic 6P (1.25): Mini Tunic Connector with 6P; ROHS: Yes

## Sheet Card Edge Connecgtor.SchDoc: Card Edge Connector
size 292 x 193 mm; SheetNumber: 2; SheetTotal: 12
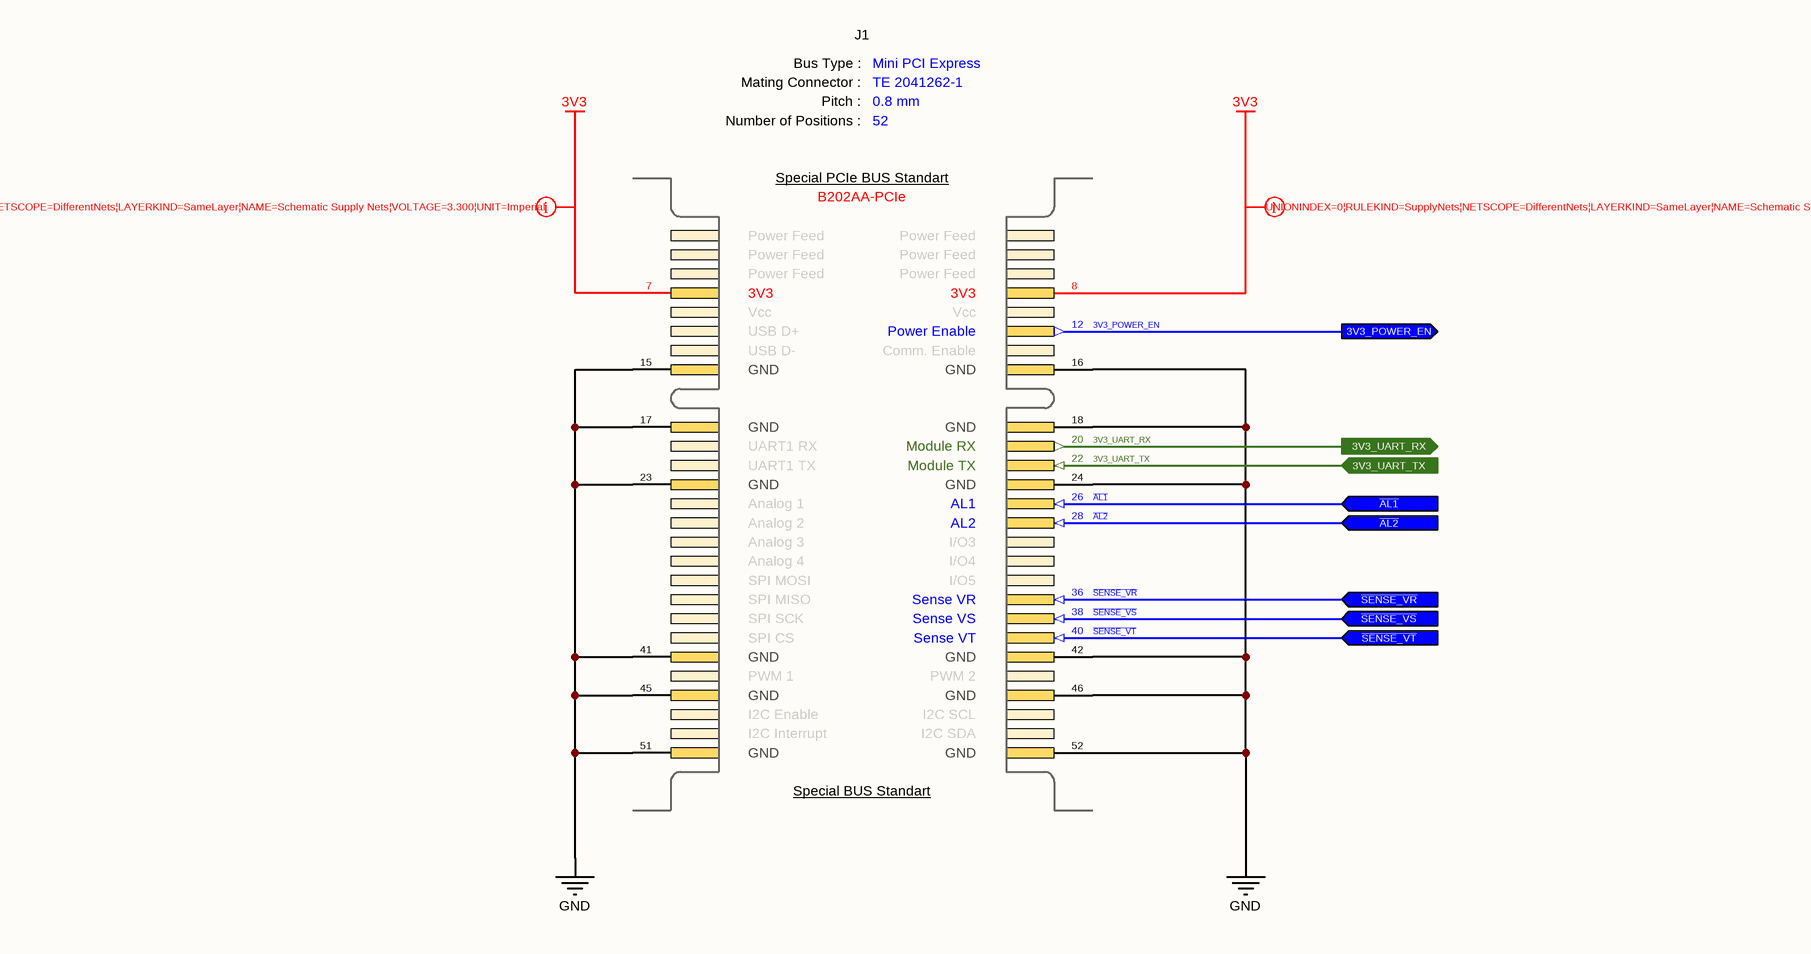
[diagram p5: Card Edge Connecgtor.SchDoc]

### Parts
J1  BUS Type: Mini PCI Express  Mating Connector: TE 2041262-1  Pitch: 0.8 mm  Number of Positions: 52  [PCB - Mini PCI Express]  (hidden comment: Connector - Mini PCI-E (Male B202AA-PCIe))  (no BOM)

### Ports
3V3_POWER_EN (out), 3V3_UART_RX (out), 3V3_UART_TX (in), ~{AL1} (in), ~{AL2} (in), ~{SENSE_VR} (in), ~{SENSE_VS} (in), ~{SENSE_VT} (in)

### Nets
3V3: J1.7(Pin-7) J1.8(Pin-8)
GND: J1.15(Pin-15) J1.16(Pin-16) J1.17(Pin-17) J1.18(Pin-18) J1.23(Pin-23) J1.24(Pin-24) J1.41(Pin-41) J1.42(Pin-42) J1.45(Pin-45) J1.46(Pin-46) J1.51(Pin-51) J1.52(Pin-52)
3V3_POWER_EN: J1.12(Pin-12) ; port 3V3_POWER_EN
3V3_UART_RX: J1.20(Pin-20) ; port 3V3_UART_RX
3V3_UART_TX: J1.22(Pin-22) ; port 3V3_UART_TX
~{AL1}: J1.26(Pin-26) ; port ~{AL1}
~{AL2}: J1.28(Pin-28) ; port ~{AL2}
~{SENSE_VR}: J1.36(Pin-36) ; port ~{SENSE_VR}
~{SENSE_VS}: J1.38(Pin-38) ; port ~{SENSE_VS}
~{SENSE_VT}: J1.40(Pin-40) ; port ~{SENSE_VT}

### Layout directives
rule Supply Nets [Voltage = 3.300]: 3V3

### Notes on the sheet
- © 2021 All rights reserved.
  This document may not, in whole or in part, be copied, photocopied, reproduced, translated or converted to any electronic or machine readable from without prior written permission of Mehmet Günce Akkoyun.
  Engineer contact : akkoyun@me.com
- Property of
- Engineer :
- Date :
- Size :
- A4
- Time :
- Project :
- Page :
- /
- Customer :
- Product ID :
- Module ID :
- Version :
- File :
- Revision :

### Library data of the parts
J1 = Connector - Mini PCI-E (Male B202AA-PCIe): Mini PCI-Express gold finger connector.; System: Connector

## Sheet R Phase Sense Signal Isolation.SchDoc: R Phase Sense Signal Isolation
size 292 x 193 mm; SheetNumber: 3; SheetTotal: 12
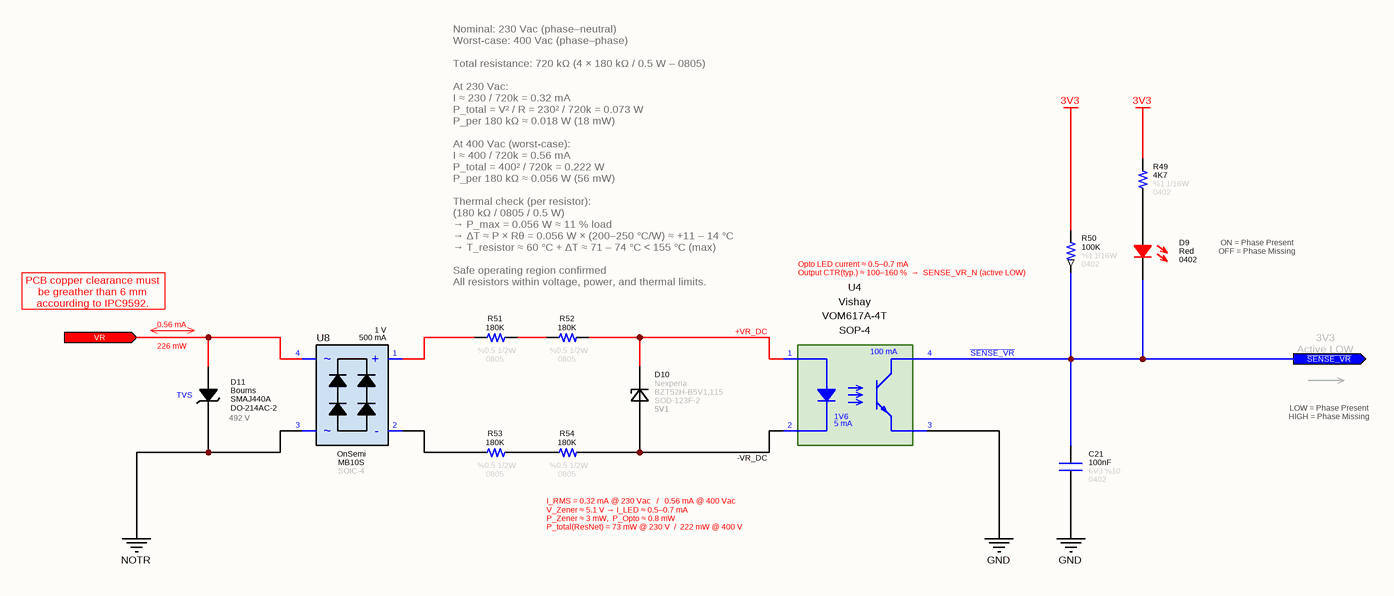
[diagram p6: R Phase Sense Signal Isolation.SchDoc]

### Parts
C21  value 100nF  Tolerance: %10  Voltage: 6V3  Case: 0402  [CAPACITOR_0402]  (hidden comment: Capacitor - 100nF [0402] (MLCC))
D9  Case: 0402  Color: Red  [LED_0402]  (hidden comment: SMD LED (Red))
D10  Zener Voltage: 5V1  Manufacturer Name: Nexperia  [SOD-123F-2]  (hidden comment: BZT52H-B5V1,115)
D11  BreakDown Voltage: 492 V  Manufacturer Name: Bourns  Case: DO-214AC-2  [DO-220AA-2]  (hidden comment: SMAJ440A)
R49  value 4K7  Tolerance: %1  Case: 0402  Power: 1/16W  [RESISTOR_0402]  (hidden comment: 4K7 - 0402 - %1 - 1/16W)
R50  value 100K  Tolerance: %1  Case: 0402  Power: 1/16W  [RESISTOR_0402]  (hidden comment: 100K - 0402 - %1 - 1/16W)
R51  value 180K  Tolerance: %0.5  Case: 0805  Power: 1/2W  [RESISTOR_0805]  (hidden comment: 180K - 0805 - %0.5 - 1/2W)
R52  value 180K  Tolerance: %0.5  Case: 0805  Power: 1/2W  [RESISTOR_0805]  (hidden comment: 180K - 0805 - %0.5 - 1/2W)
R53  value 180K  Tolerance: %0.5  Case: 0805  Power: 1/2W  [RESISTOR_0805]  (hidden comment: 180K - 0805 - %0.5 - 1/2W)
R54  value 180K  Tolerance: %0.5  Case: 0805  Power: 1/2W  [RESISTOR_0805]  (hidden comment: 180K - 0805 - %0.5 - 1/2W)
U4  Manufacturer Name: Vishay  Case: SOP-4  If - Forward Current: 5 mA  Vf - Forward Voltage: 1V6  Maximum Collector Current: 100 mA  [SOP-4V2]  (hidden comment: VOM617A-4T)
U8  If - Forward Current: 500 mA  Vf - Forward Voltage: 1 V  Manufacturer Name: OnSemi  Manufacturer Part Number: MB10S  [SOIC-4]  (hidden comment: LTV-846S)

### Ports
VR (in), ~{SENSE_VR} (out)

### Nets
3V3: R49.2 R50.2
GND: C21.1 U4.3(Emiter)
NOTR: D11.2(Cathode) U8.3
+VR_DC: D10.1(Cathode) R52.1 U4.1(LED_Anode)
-VR_DC: D10.2(Anode) R54.1 U4.2(LED_Cathode)
~{SENSE_VR}: C21.2 D9.1 R50.1 U4.4(Collector) ; port ~{SENSE_VR}
VR: D11.1(Anode) U8.4 ; port VR
NetD9_2: D9.2 R49.1
NetR51_1: R51.1 R52.2
NetR51_2: R51.2 U8.1(+)
NetR53_1: R53.1 R54.2
NetR53_2: R53.2 U8.2(-)

### Notes on the sheet
- (near R50) Opto LED current ≈ 0.5–0.7 mA
  Output CTR(typ.) ≈ 100–160 %  →  SENSE_VR_N (active LOW)
- ON = Phase Present
  OFF = Phase Missing
- PCB copper clearance must be greather than 6 mm accourding to IPC9592.
- 0.56 mA
- (near D11) 226 mW
- Nominal: 230 Vac (phase–neutral)
  Worst-case: 400 Vac (phase–phase)
  Total resistance: 720 kΩ (4 × 180 kΩ / 0.5 W – 0805)
  At 230 Vac:
  I ≈ 230 / 720k = 0.32 mA
  P_total = V² / R = 230² / 720k = 0.073 W
  P_per 180 kΩ ≈ 0.018 W (18 mW)
  At 400 Vac (worst-case):
  I ≈ 400 / 720k = 0.56 mA
  P_total = 400² / 720k = 0.222 W
  P_per 180 kΩ ≈ 0.056 W (56 mW)
  Thermal check (per resistor):
  (180 kΩ / 0805 / 0.5 W)
  → P_max = 0.056 W ≈ 11 % load
  → ΔT ≈ P × Rθ = 0.056 W × (200–250 °C/W) ≈ +11 – 14 °C
  → T_resistor ≈ 60 °C + ΔT ≈ 71 – 74 °C < 155 °C (max)
  Safe operating region confirmed
  All resistors within voltage, power, and thermal limits.
- 3V3
  Active LOW
- LOW = Phase Present
  HIGH = Phase Missing
- I_RMS = 0.32 mA @ 230 Vac   /   0.56 mA @ 400 Vac
  V_Zener ≈ 5.1 V → I_LED ≈ 0.5–0.7 mA
  P_Zener ≈ 3 mW,  P_Opto ≈ 0.8 mW
  P_total(ResNet) = 73 mW @ 230 V  /  222 mW @ 400 V
- © 2021 All rights reserved.
  This document may not, in whole or in part, be copied, photocopied, reproduced, translated or converted to any electronic or machine readable from without prior written permission of Mehmet Günce Akkoyun.
  Engineer contact : akkoyun@me.com
- Property of
- Engineer :
- Date :
- Size :
- A4
- Time :
- Project :
- Page :
- /
- Customer :
- Product ID :
- Module ID :
- Version :
- File :
- Revision :
- (in symbol Diode - SMAJ440A (TVS)) TVS

### Library data of the parts
C21 = Capacitor - 100nF [0402-6V3]: Capacitor (MLCC) - 100nF / 6V3 / 0402; Manufacturer Name: KYOCERA AVX; Manufacturer Part Number: 04026D104KAT4A; ComponentLink1Description: Mouser; ComponentLink1URL: https://www.mouser.com.tr/ProductDetail/AVX/04026D104KAT4A?qs=sGAEpiMZZMs0AnBnWHyRQPg4iYkCw7IMED%2F4kpqgf7w%3D; ComponentLink2Description: DataSheet; ComponentLink2URL: https://www.mouser.com.tr/datasheet/2/40/cx5r-776519.pdf; Subcategory: Capacitors
D9 = Diode - LED (0402-Red): Standard LEDs - SMD MINI-MOLD ULTRA COMPACT RED; Manufacturer Name: ROHM Semiconductor; Manufacturer Part Number: SML-P12VTT86R; ROHS: Yes; ComponentLink1Description: DataSheet; ComponentLink1URL: https://www.mouser.com.tr/datasheet/2/348/sml-p1-e-1139198.pdf; ComponentLink2Description: Mouser; ComponentLink2URL: https://www.mouser.com.tr/ProductDetail/ROHM-Semiconductor/SML-P12U2TT86R?qs=sGAEpiMZZMseGfSY3csMkRIBDsfU3UCXJTULB5gem9Ta%252Bp%252BvZ709fg%3D%3D
D10 = Diode - BZT52H-B5V1,115: Zener Diodes BZT52H-B5V1/SOD123F/SOD2; Product Type: Zener Diodes; RoHS: Yes; Manufacturer Part Number: BZT52H-B5V1,115; Case: SOD-123F-2
D11 = Diode - SMAJ440A (TVS): ESD Protection Diodes / TVS Diodes 440volts 1uA .6 Amps Uni-Dir; Peak Pulse Current: 600 mA; Working Voltage: 440 V; Clamping Voltage: 713 V; Product Type: TVS Diodes; RoHS: Yes; Manufacturer Part Number: SMAJ440A
R49 = Resistor - 4K7 [0402]: Thick Film Resistors - SMD 1/16 W 4.7 KOhm 1%; Manufacturer Name: Vishay; Manufacturer Part Number: CRCW04024K70FKED; ComponentLink1Description: DataSheet; ComponentLink1URL: https://www.mouser.com.tr/datasheet/2/427/dcrcwe3-1762152.pdf; ComponentLink2Description: Mouser; ComponentLink2URL: https://www.mouser.com.tr/ProductDetail/Vishay-Dale/CRCW04024K70FKED?qs=sGAEpiMZZMu61qfTUdNhG7nHf%2F6MTUn3HadIdDQu24Q%3D
R50 = Resistor - 100K [0402]: Thick Film Resistors - SMD 1/16 W 100 KOhm 1%; Manufacturer Name: Vishay; Manufacturer Part Number: CRCW0402100KFKED; ComponentLink1Description: DataSheet; ComponentLink1URL: https://www.mouser.com.tr/datasheet/2/427/dcrcwe3-1762152.pdf; ComponentLink2Description: Mouser; ComponentLink2URL: https://www.mouser.com.tr/ProductDetail/Vishay-Dale/CRCW040210K0FKED?qs=sGAEpiMZZMu61qfTUdNhG2DpbjADlD3GcalbOv9utCY%3D
R51-R54 = Resistor - 180K [0805]: Thick Film Resistors - SMD 0805 180Kohms 0.5W 0.5% AEC-Q200; Manufacturer Name: Panasonic; Manufacturer Part Number: ERJ-P06D1803V; ComponentLink1Description: DataSheet; ComponentLink1URL: https://www.mouser.com.tr/datasheet/2/427/dcrcwe3-1762152.pdf; ComponentLink2Description: Mouser; ComponentLink2URL: https://www.mouser.com.tr/ProductDetail/Vishay-Dale/CRCW040210K0FKED?qs=sGAEpiMZZMu61qfTUdNhG2DpbjADlD3GcalbOv9utCY%3D
U4 = IC - VOM617A: Transistor Output Optocouplers Phototransistor Out CTR 160-320% 5mA; RoHS: Yes; Product Type: Transistor Output Optocouplers; Manufacturer Part Number: VOM617A-4T
U8 = IC - MB10S: Transistor Output Optocouplers Optocplr Phototrans 4-Channel; Case: SOIC-4

## Sheet S Phase Sense Signal Isolation.SchDoc: S Phase Sense Signal Isolation
size 292 x 193 mm; SheetNumber: 4; SheetTotal: 12
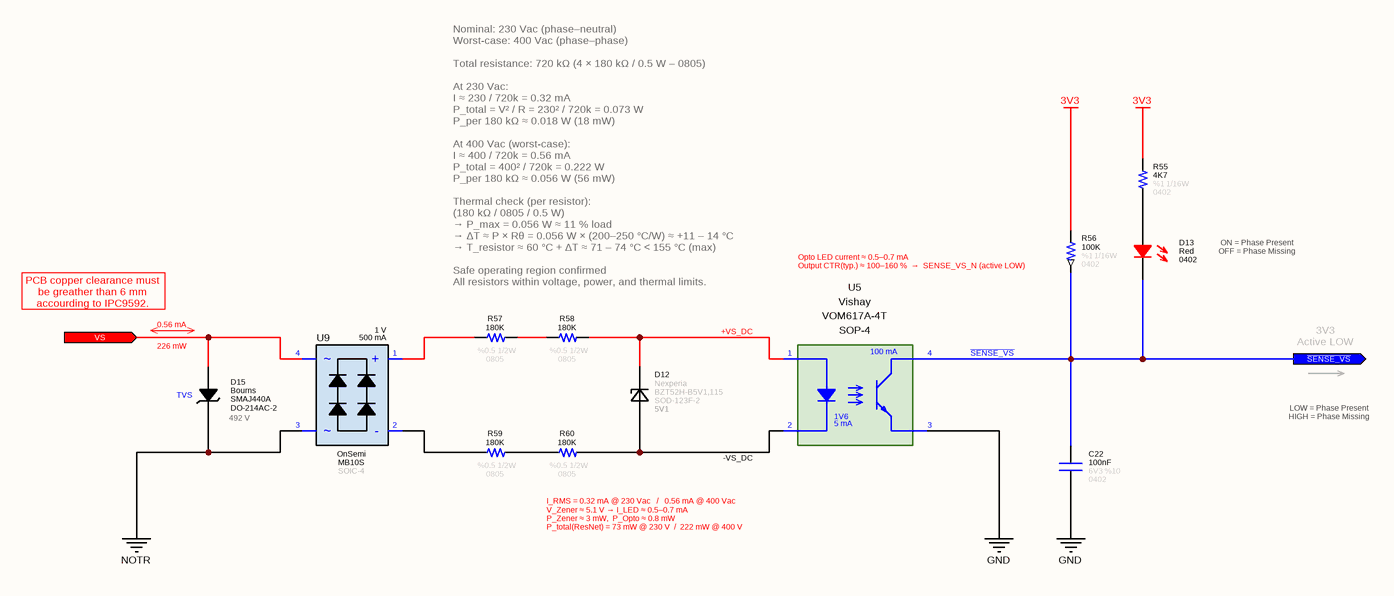
[diagram p7: S Phase Sense Signal Isolation.SchDoc]

### Parts
C22  value 100nF  Tolerance: %10  Voltage: 6V3  Case: 0402  [CAPACITOR_0402]  (hidden comment: Capacitor - 100nF [0402] (MLCC))
D12  Zener Voltage: 5V1  Manufacturer Name: Nexperia  [SOD-123F-2]  (hidden comment: BZT52H-B5V1,115)
D13  Case: 0402  Color: Red  [LED_0402]  (hidden comment: SMD LED (Red))
D15  BreakDown Voltage: 492 V  Manufacturer Name: Bourns  Case: DO-214AC-2  [DO-220AA-2]  (hidden comment: SMAJ440A)
R55  value 4K7  Tolerance: %1  Case: 0402  Power: 1/16W  [RESISTOR_0402]  (hidden comment: 4K7 - 0402 - %1 - 1/16W)
R56  value 100K  Tolerance: %1  Case: 0402  Power: 1/16W  [RESISTOR_0402]  (hidden comment: 100K - 0402 - %1 - 1/16W)
R57  value 180K  Tolerance: %0.5  Case: 0805  Power: 1/2W  [RESISTOR_0805]  (hidden comment: 180K - 0805 - %0.5 - 1/2W)
R58  value 180K  Tolerance: %0.5  Case: 0805  Power: 1/2W  [RESISTOR_0805]  (hidden comment: 180K - 0805 - %0.5 - 1/2W)
R59  value 180K  Tolerance: %0.5  Case: 0805  Power: 1/2W  [RESISTOR_0805]  (hidden comment: 180K - 0805 - %0.5 - 1/2W)
R60  value 180K  Tolerance: %0.5  Case: 0805  Power: 1/2W  [RESISTOR_0805]  (hidden comment: 180K - 0805 - %0.5 - 1/2W)
U5  Manufacturer Name: Vishay  Case: SOP-4  If - Forward Current: 5 mA  Vf - Forward Voltage: 1V6  Maximum Collector Current: 100 mA  [SOP-4V2]  (hidden comment: VOM617A-4T)
U9  If - Forward Current: 500 mA  Vf - Forward Voltage: 1 V  Manufacturer Name: OnSemi  Manufacturer Part Number: MB10S  [SOIC-4]  (hidden comment: LTV-846S)

### Ports
VS (in), ~{SENSE_VS} (out)

### Nets
3V3: R55.2 R56.2
GND: C22.1 U5.3(Emiter)
NOTR: D15.2(Cathode) U9.3
+VS_DC: D12.1(Cathode) R58.1 U5.1(LED_Anode)
-VS_DC: D12.2(Anode) R60.1 U5.2(LED_Cathode)
~{SENSE_VS}: C22.2 D13.1 R56.1 U5.4(Collector) ; port ~{SENSE_VS}
VS: D15.1(Anode) U9.4 ; port VS
NetD13_2: D13.2 R55.1
NetR57_1: R57.1 R58.2
NetR57_2: R57.2 U9.1(+)
NetR59_1: R59.1 R60.2
NetR59_2: R59.2 U9.2(-)

### Notes on the sheet
- (near R56) Opto LED current ≈ 0.5–0.7 mA
  Output CTR(typ.) ≈ 100–160 %  →  SENSE_VS_N (active LOW)
- ON = Phase Present
  OFF = Phase Missing
- PCB copper clearance must be greather than 6 mm accourding to IPC9592.
- 0.56 mA
- (near D15) 226 mW
- Nominal: 230 Vac (phase–neutral)
  Worst-case: 400 Vac (phase–phase)
  Total resistance: 720 kΩ (4 × 180 kΩ / 0.5 W – 0805)
  At 230 Vac:
  I ≈ 230 / 720k = 0.32 mA
  P_total = V² / R = 230² / 720k = 0.073 W
  P_per 180 kΩ ≈ 0.018 W (18 mW)
  At 400 Vac (worst-case):
  I ≈ 400 / 720k = 0.56 mA
  P_total = 400² / 720k = 0.222 W
  P_per 180 kΩ ≈ 0.056 W (56 mW)
  Thermal check (per resistor):
  (180 kΩ / 0805 / 0.5 W)
  → P_max = 0.056 W ≈ 11 % load
  → ΔT ≈ P × Rθ = 0.056 W × (200–250 °C/W) ≈ +11 – 14 °C
  → T_resistor ≈ 60 °C + ΔT ≈ 71 – 74 °C < 155 °C (max)
  Safe operating region confirmed
  All resistors within voltage, power, and thermal limits.
- 3V3
  Active LOW
- LOW = Phase Present
  HIGH = Phase Missing
- I_RMS = 0.32 mA @ 230 Vac   /   0.56 mA @ 400 Vac
  V_Zener ≈ 5.1 V → I_LED ≈ 0.5–0.7 mA
  P_Zener ≈ 3 mW,  P_Opto ≈ 0.8 mW
  P_total(ResNet) = 73 mW @ 230 V  /  222 mW @ 400 V
- © 2021 All rights reserved.
  This document may not, in whole or in part, be copied, photocopied, reproduced, translated or converted to any electronic or machine readable from without prior written permission of Mehmet Günce Akkoyun.
  Engineer contact : akkoyun@me.com
- Property of
- Engineer :
- Date :
- Size :
- A4
- Time :
- Project :
- Page :
- /
- Customer :
- Product ID :
- Module ID :
- Version :
- File :
- Revision :
- (in symbol Diode - SMAJ440A (TVS)) TVS

### Library data of the parts
C22 = Capacitor - 100nF [0402-6V3]: as C21 on sheet R Phase Sense Signal Isolation; ComponentLink1Description: Mouser; ComponentLink1URL: https://www.mouser.com.tr/ProductDetail/AVX/04026D104KAT4A?qs=sGAEpiMZZMs0AnBnWHyRQPg4iYkCw7IMED%2F4kpqgf7w%3D; ComponentLink2Description: DataSheet; ComponentLink2URL: https://www.mouser.com.tr/datasheet/2/40/cx5r-776519.pdf; Subcategory: Capacitors
D12 = Diode - BZT52H-B5V1,115: Zener Diodes BZT52H-B5V1/SOD123F/SOD2; Product Type: Zener Diodes; RoHS: Yes; Manufacturer Part Number: BZT52H-B5V1,115; Case: SOD-123F-2
D13 = Diode - LED (0402-Red): as D9 on sheet R Phase Sense Signal Isolation; ROHS: Yes; ComponentLink1Description: DataSheet; ComponentLink1URL: https://www.mouser.com.tr/datasheet/2/348/sml-p1-e-1139198.pdf; ComponentLink2Description: Mouser; ComponentLink2URL: https://www.mouser.com.tr/ProductDetail/ROHM-Semiconductor/SML-P12U2TT86R?qs=sGAEpiMZZMseGfSY3csMkRIBDsfU3UCXJTULB5gem9Ta%252Bp%252BvZ709fg%3D%3D
D15 = Diode - SMAJ440A (TVS): as D11 on sheet R Phase Sense Signal Isolation; Product Type: TVS Diodes; RoHS: Yes; Manufacturer Part Number: SMAJ440A
R55 = Resistor - 4K7 [0402]: as R49 on sheet R Phase Sense Signal Isolation; ComponentLink1Description: DataSheet; ComponentLink1URL: https://www.mouser.com.tr/datasheet/2/427/dcrcwe3-1762152.pdf; ComponentLink2Description: Mouser; ComponentLink2URL: https://www.mouser.com.tr/ProductDetail/Vishay-Dale/CRCW04024K70FKED?qs=sGAEpiMZZMu61qfTUdNhG7nHf%2F6MTUn3HadIdDQu24Q%3D
R56 = Resistor - 100K [0402]: as R50 on sheet R Phase Sense Signal Isolation; ComponentLink1Description: DataSheet; ComponentLink1URL: https://www.mouser.com.tr/datasheet/2/427/dcrcwe3-1762152.pdf; ComponentLink2Description: Mouser; ComponentLink2URL: https://www.mouser.com.tr/ProductDetail/Vishay-Dale/CRCW040210K0FKED?qs=sGAEpiMZZMu61qfTUdNhG2DpbjADlD3GcalbOv9utCY%3D
R57-R60 = Resistor - 180K [0805]: as R51 on sheet R Phase Sense Signal Isolation; ComponentLink1Description: DataSheet; ComponentLink1URL: https://www.mouser.com.tr/datasheet/2/427/dcrcwe3-1762152.pdf; ComponentLink2Description: Mouser; ComponentLink2URL: https://www.mouser.com.tr/ProductDetail/Vishay-Dale/CRCW040210K0FKED?qs=sGAEpiMZZMu61qfTUdNhG2DpbjADlD3GcalbOv9utCY%3D
U5 = IC - VOM617A: as U4 on sheet R Phase Sense Signal Isolation; RoHS: Yes; Product Type: Transistor Output Optocouplers; Manufacturer Part Number: VOM617A-4T
U9 = IC - MB10S: as U8 on sheet R Phase Sense Signal Isolation; Case: SOIC-4

## Sheet T Phase Sense Signal Isolation.SchDoc: T Phase Sense Signal Isolation
size 292 x 193 mm; SheetNumber: 5; SheetTotal: 12
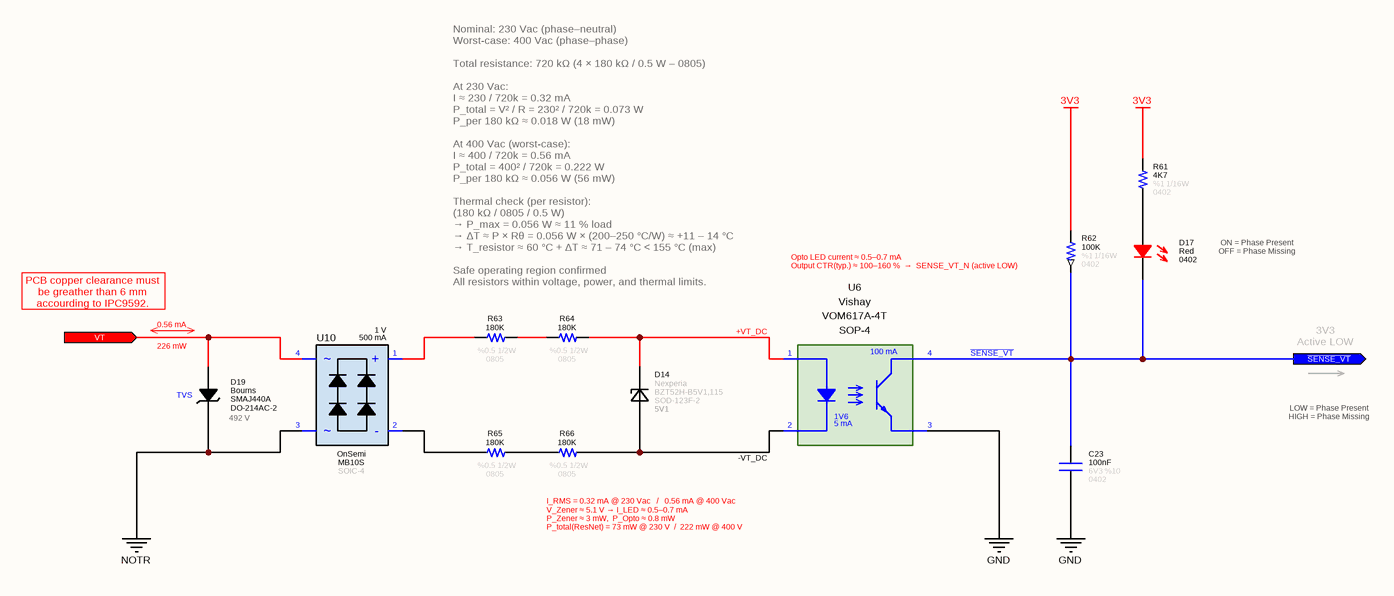
[diagram p8: T Phase Sense Signal Isolation.SchDoc]

### Parts
C23  value 100nF  Tolerance: %10  Voltage: 6V3  Case: 0402  [CAPACITOR_0402]  (hidden comment: Capacitor - 100nF [0402] (MLCC))
D14  Zener Voltage: 5V1  Manufacturer Name: Nexperia  [SOD-123F-2]  (hidden comment: BZT52H-B5V1,115)
D17  Case: 0402  Color: Red  [LED_0402]  (hidden comment: SMD LED (Red))
D19  BreakDown Voltage: 492 V  Manufacturer Name: Bourns  Case: DO-214AC-2  [DO-220AA-2]  (hidden comment: SMAJ440A)
R61  value 4K7  Tolerance: %1  Case: 0402  Power: 1/16W  [RESISTOR_0402]  (hidden comment: 4K7 - 0402 - %1 - 1/16W)
R62  value 100K  Tolerance: %1  Case: 0402  Power: 1/16W  [RESISTOR_0402]  (hidden comment: 100K - 0402 - %1 - 1/16W)
R63  value 180K  Tolerance: %0.5  Case: 0805  Power: 1/2W  [RESISTOR_0805]  (hidden comment: 180K - 0805 - %0.5 - 1/2W)
R64  value 180K  Tolerance: %0.5  Case: 0805  Power: 1/2W  [RESISTOR_0805]  (hidden comment: 180K - 0805 - %0.5 - 1/2W)
R65  value 180K  Tolerance: %0.5  Case: 0805  Power: 1/2W  [RESISTOR_0805]  (hidden comment: 180K - 0805 - %0.5 - 1/2W)
R66  value 180K  Tolerance: %0.5  Case: 0805  Power: 1/2W  [RESISTOR_0805]  (hidden comment: 180K - 0805 - %0.5 - 1/2W)
U6  Manufacturer Name: Vishay  Case: SOP-4  If - Forward Current: 5 mA  Vf - Forward Voltage: 1V6  Maximum Collector Current: 100 mA  [SOP-4V2]  (hidden comment: VOM617A-4T)
U10  If - Forward Current: 500 mA  Vf - Forward Voltage: 1 V  Manufacturer Name: OnSemi  Manufacturer Part Number: MB10S  [SOIC-4]  (hidden comment: LTV-846S)

### Ports
VT (in), ~{SENSE_VT} (out)

### Nets
3V3: R61.2 R62.2
GND: C23.1 U6.3(Emiter)
NOTR: D19.2(Cathode) U10.3
+VT_DC: D14.1(Cathode) R64.1 U6.1(LED_Anode)
-VT_DC: D14.2(Anode) R66.1 U6.2(LED_Cathode)
~{SENSE_VT}: C23.2 D17.1 R62.1 U6.4(Collector) ; port ~{SENSE_VT}
VT: D19.1(Anode) U10.4 ; port VT
NetD17_2: D17.2 R61.1
NetR63_1: R63.1 R64.2
NetR63_2: R63.2 U10.1(+)
NetR65_1: R65.1 R66.2
NetR65_2: R65.2 U10.2(-)

### Notes on the sheet
- (near R62) Opto LED current ≈ 0.5–0.7 mA
  Output CTR(typ.) ≈ 100–160 %  →  SENSE_VT_N (active LOW)
- ON = Phase Present
  OFF = Phase Missing
- PCB copper clearance must be greather than 6 mm accourding to IPC9592.
- 0.56 mA
- (near D19) 226 mW
- Nominal: 230 Vac (phase–neutral)
  Worst-case: 400 Vac (phase–phase)
  Total resistance: 720 kΩ (4 × 180 kΩ / 0.5 W – 0805)
  At 230 Vac:
  I ≈ 230 / 720k = 0.32 mA
  P_total = V² / R = 230² / 720k = 0.073 W
  P_per 180 kΩ ≈ 0.018 W (18 mW)
  At 400 Vac (worst-case):
  I ≈ 400 / 720k = 0.56 mA
  P_total = 400² / 720k = 0.222 W
  P_per 180 kΩ ≈ 0.056 W (56 mW)
  Thermal check (per resistor):
  (180 kΩ / 0805 / 0.5 W)
  → P_max = 0.056 W ≈ 11 % load
  → ΔT ≈ P × Rθ = 0.056 W × (200–250 °C/W) ≈ +11 – 14 °C
  → T_resistor ≈ 60 °C + ΔT ≈ 71 – 74 °C < 155 °C (max)
  Safe operating region confirmed
  All resistors within voltage, power, and thermal limits.
- 3V3
  Active LOW
- LOW = Phase Present
  HIGH = Phase Missing
- I_RMS = 0.32 mA @ 230 Vac   /   0.56 mA @ 400 Vac
  V_Zener ≈ 5.1 V → I_LED ≈ 0.5–0.7 mA
  P_Zener ≈ 3 mW,  P_Opto ≈ 0.8 mW
  P_total(ResNet) = 73 mW @ 230 V  /  222 mW @ 400 V
- © 2021 All rights reserved.
  This document may not, in whole or in part, be copied, photocopied, reproduced, translated or converted to any electronic or machine readable from without prior written permission of Mehmet Günce Akkoyun.
  Engineer contact : akkoyun@me.com
- Property of
- Engineer :
- Date :
- Size :
- A4
- Time :
- Project :
- Page :
- /
- Customer :
- Product ID :
- Module ID :
- Version :
- File :
- Revision :
- (in symbol Diode - SMAJ440A (TVS)) TVS

### Library data of the parts
C23 = Capacitor - 100nF [0402-6V3]: as C21 on sheet R Phase Sense Signal Isolation; ComponentLink1Description: Mouser; ComponentLink1URL: https://www.mouser.com.tr/ProductDetail/AVX/04026D104KAT4A?qs=sGAEpiMZZMs0AnBnWHyRQPg4iYkCw7IMED%2F4kpqgf7w%3D; ComponentLink2Description: DataSheet; ComponentLink2URL: https://www.mouser.com.tr/datasheet/2/40/cx5r-776519.pdf; Subcategory: Capacitors
D14 = Diode - BZT52H-B5V1,115: Zener Diodes BZT52H-B5V1/SOD123F/SOD2; Product Type: Zener Diodes; RoHS: Yes; Manufacturer Part Number: BZT52H-B5V1,115; Case: SOD-123F-2
D17 = Diode - LED (0402-Red): as D9 on sheet R Phase Sense Signal Isolation; ROHS: Yes; ComponentLink1Description: DataSheet; ComponentLink1URL: https://www.mouser.com.tr/datasheet/2/348/sml-p1-e-1139198.pdf; ComponentLink2Description: Mouser; ComponentLink2URL: https://www.mouser.com.tr/ProductDetail/ROHM-Semiconductor/SML-P12U2TT86R?qs=sGAEpiMZZMseGfSY3csMkRIBDsfU3UCXJTULB5gem9Ta%252Bp%252BvZ709fg%3D%3D
D19 = Diode - SMAJ440A (TVS): as D11 on sheet R Phase Sense Signal Isolation; Product Type: TVS Diodes; RoHS: Yes; Manufacturer Part Number: SMAJ440A
R61 = Resistor - 4K7 [0402]: as R49 on sheet R Phase Sense Signal Isolation; ComponentLink1Description: DataSheet; ComponentLink1URL: https://www.mouser.com.tr/datasheet/2/427/dcrcwe3-1762152.pdf; ComponentLink2Description: Mouser; ComponentLink2URL: https://www.mouser.com.tr/ProductDetail/Vishay-Dale/CRCW04024K70FKED?qs=sGAEpiMZZMu61qfTUdNhG7nHf%2F6MTUn3HadIdDQu24Q%3D
R62 = Resistor - 100K [0402]: as R50 on sheet R Phase Sense Signal Isolation; ComponentLink1Description: DataSheet; ComponentLink1URL: https://www.mouser.com.tr/datasheet/2/427/dcrcwe3-1762152.pdf; ComponentLink2Description: Mouser; ComponentLink2URL: https://www.mouser.com.tr/ProductDetail/Vishay-Dale/CRCW040210K0FKED?qs=sGAEpiMZZMu61qfTUdNhG2DpbjADlD3GcalbOv9utCY%3D
R63-R66 = Resistor - 180K [0805]: as R51 on sheet R Phase Sense Signal Isolation; ComponentLink1Description: DataSheet; ComponentLink1URL: https://www.mouser.com.tr/datasheet/2/427/dcrcwe3-1762152.pdf; ComponentLink2Description: Mouser; ComponentLink2URL: https://www.mouser.com.tr/ProductDetail/Vishay-Dale/CRCW040210K0FKED?qs=sGAEpiMZZMu61qfTUdNhG2DpbjADlD3GcalbOv9utCY%3D
U6 = IC - VOM617A: as U4 on sheet R Phase Sense Signal Isolation; RoHS: Yes; Product Type: Transistor Output Optocouplers; Manufacturer Part Number: VOM617A-4T
U10 = IC - MB10S: as U8 on sheet R Phase Sense Signal Isolation; Case: SOIC-4